# Altium schematic sheet ADC_Driver.SchDoc
size A4
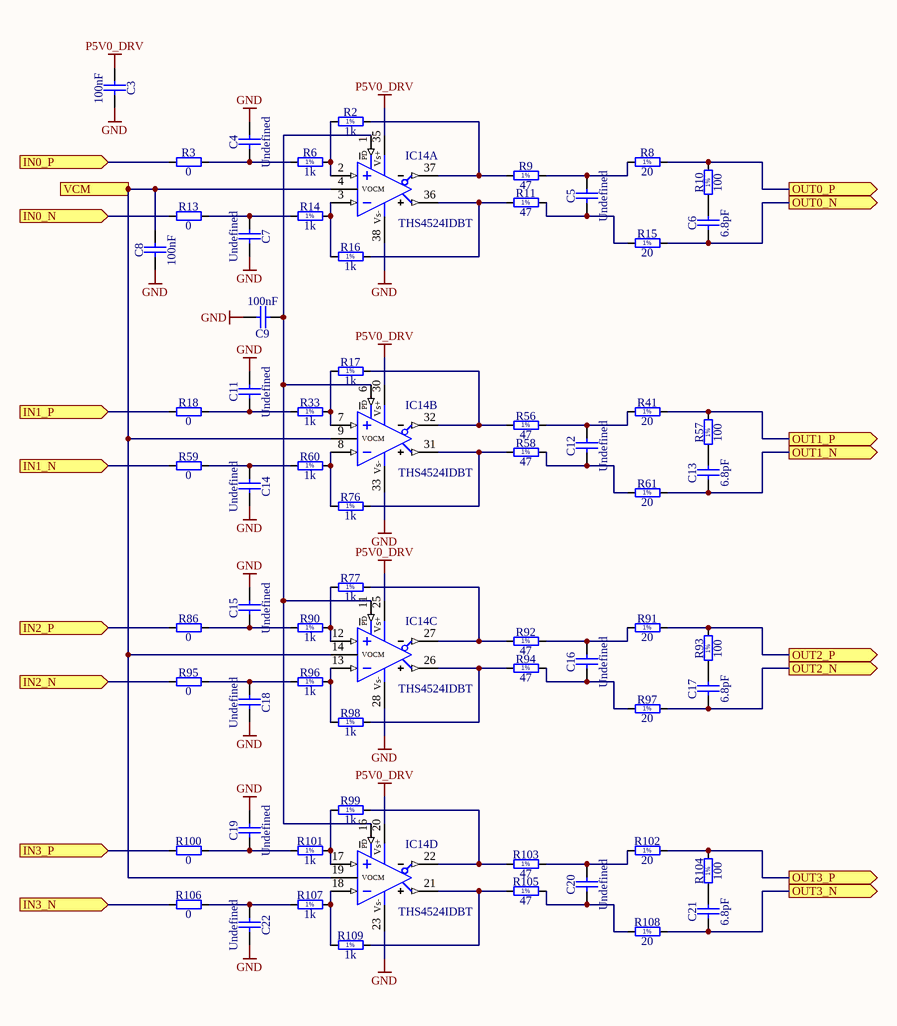
[diagram p0: ADC_Driver.SchDoc]

## Parts
C3  100nF  [CAPC0603X33N]
C4  Undefined  [CAPC1005X55N]
C5  Undefined  [CAPC1005X55N]
C6  6.8pF  [CAPC1005X70N]
C7  Undefined  [CAPC1005X55N]
C8  100nF  [CAPC0603X33N]
C9  100nF  [CAPC0603X33N]
C11  Undefined  [CAPC1005X55N]
C12  Undefined  [CAPC1005X55N]
C13  6.8pF  [CAPC1005X70N]
C14  Undefined  [CAPC1005X55N]
C15  Undefined  [CAPC1005X55N]
C16  Undefined  [CAPC1005X55N]
C17  6.8pF  [CAPC1005X70N]
C18  Undefined  [CAPC1005X55N]
C19  Undefined  [CAPC1005X55N]
C20  Undefined  [CAPC1005X55N]
C21  6.8pF  [CAPC1005X70N]
C22  Undefined  [CAPC1005X55N]
IC14  THS4524IDBT  [SOP50P640X120-38N]  (parts A,B,C,D of 5)
R2  1k  [RESC1005X40N]
R3  0  [RESC1005X40N]
R6  1k  [RESC1005X40N]
R8  20  [RESC1005X40N]
R9  47  [RESC1005X40N]
R10  100  [RESC0603X28N]
R11  47  [RESC1005X40N]
R13  0  [RESC1005X40N]
R14  1k  [RESC1005X40N]
R15  20  [RESC1005X40N]
R16  1k  [RESC1005X40N]
R17  1k  [RESC1005X40N]
R18  0  [RESC1005X40N]
R33  1k  [RESC1005X40N]
R41  20  [RESC1005X40N]
R56  47  [RESC1005X40N]
R57  100  [RESC0603X28N]
R58  47  [RESC1005X40N]
R59  0  [RESC1005X40N]
R60  1k  [RESC1005X40N]
R61  20  [RESC1005X40N]
R76  1k  [RESC1005X40N]
R77  1k  [RESC1005X40N]
R86  0  [RESC1005X40N]
R90  1k  [RESC1005X40N]
R91  20  [RESC1005X40N]
R92  47  [RESC1005X40N]
R93  100  [RESC0603X28N]
R94  47  [RESC1005X40N]
R95  0  [RESC1005X40N]
R96  1k  [RESC1005X40N]
R97  20  [RESC1005X40N]
R98  1k  [RESC1005X40N]
R99  1k  [RESC1005X40N]
R100  0  [RESC1005X40N]
R101  1k  [RESC1005X40N]
R102  20  [RESC1005X40N]
R103  47  [RESC1005X40N]
R104  100  [RESC0603X28N]
R105  47  [RESC1005X40N]
R106  0  [RESC1005X40N]
R107  1k  [RESC1005X40N]
R108  20  [RESC1005X40N]
R109  1k  [RESC1005X40N]

## Ports
IN0_N (in), IN0_P (in), IN1_N (in), IN1_P (in), IN2_N (in), IN2_P (in), IN3_N (in), IN3_P (in), OUT0_N (out), OUT0_P (out), OUT1_N (out), OUT1_P (out), OUT2_N (out), OUT2_P (out), OUT3_N (out), OUT3_P (out), VCM (in)

## Nets
GND: C3.2 C4.2 C7.2 C8.1 C9.2 C11.2 C14.2 C15.2 C18.2 C19.2 C22.2 IC14.23(Vs-) IC14.28(Vs-) IC14.33(Vs-) IC14.38(Vs-)
P5V0_DRV: C3.1 IC14.20(Vs+) IC14.25(Vs+) IC14.30(Vs+) IC14.35(Vs+)
IN0_N: R13.1 ; port IN0_N
IN0_P: R3.1 ; port IN0_P
IN1_N: R59.1 ; port IN1_N
IN1_P: R18.1 ; port IN1_P
IN2_N: R95.1 ; port IN2_N
IN2_P: R86.1 ; port IN2_P
IN3_N: R106.1 ; port IN3_N
IN3_P: R100.1 ; port IN3_P
OUT0_N: C6.1 R15.2 ; port OUT0_N
OUT0_P: R8.2 R10.2 ; port OUT0_P
OUT1_N: C13.1 R61.2 ; port OUT1_N
OUT1_P: R41.2 R57.2 ; port OUT1_P
OUT2_N: C17.1 R97.2 ; port OUT2_N
OUT2_P: R91.2 R93.2 ; port OUT2_P
OUT3_N: C21.1 R108.2 ; port OUT3_N
OUT3_P: R102.2 R104.2 ; port OUT3_P
VCM: C8.2 IC14.4(VOCM) IC14.9(VOCM) IC14.14(VOCM) IC14.19(VOCM) ; port VCM
NetC4_1: C4.1 R3.2 R6.1
NetC5_1: C5.1 R11.2 R15.1
NetC5_2: C5.2 R8.1 R9.2
NetC6_2: C6.2 R10.1
NetC7_1: C7.1 R13.2 R14.1
NetC9_1: C9.1 IC14.1(~{PD}) IC14.6(~{PD}) IC14.11(~{PD}) IC14.16(~{PD})
NetC11_1: C11.1 R18.2 R33.1
NetC12_1: C12.1 R58.2 R61.1
NetC12_2: C12.2 R41.1 R56.2
NetC13_2: C13.2 R57.1
NetC14_1: C14.1 R59.2 R60.1
NetC15_1: C15.1 R86.2 R90.1
NetC16_1: C16.1 R94.2 R97.1
NetC16_2: C16.2 R91.1 R92.2
NetC17_2: C17.2 R93.1
NetC18_1: C18.1 R95.2 R96.1
NetC19_1: C19.1 R100.2 R101.1
NetC20_1: C20.1 R105.2 R108.1
NetC20_2: C20.2 R102.1 R103.2
NetC21_2: C21.2 R104.1
NetC22_1: C22.1 R106.2 R107.1
NetIC14_2: IC14.2(IN+) R2.1 R6.2
NetIC14_3: IC14.3(IN-) R14.2 R16.1
NetIC14_7: IC14.7(IN+) R17.1 R33.2
NetIC14_8: IC14.8(IN-) R60.2 R76.1
NetIC14_12: IC14.12(IN+) R77.1 R90.2
NetIC14_13: IC14.13(IN-) R96.2 R98.1
NetIC14_17: IC14.17(IN+) R99.1 R101.2
NetIC14_18: IC14.18(IN-) R107.2 R109.1
NetIC14_21: IC14.21(VOUT+) R105.1 R109.2
NetIC14_22: IC14.22(VOUT-) R99.2 R103.1
NetIC14_26: IC14.26(VOUT+) R94.1 R98.2
NetIC14_27: IC14.27(VOUT-) R77.2 R92.1
NetIC14_31: IC14.31(VOUT+) R58.1 R76.2
NetIC14_32: IC14.32(VOUT-) R17.2 R56.1
NetIC14_36: IC14.36(VOUT+) R11.1 R16.2
NetIC14_37: IC14.37(VOUT-) R2.2 R9.1

## Notes on the sheet
- (in symbol R0201_100R_1%_0.05W_200PPM) 1%
- (in symbol R0402_1K_1%_0.0625W_100PPM) 1%
- (in symbol R0402_20R_1%_0.0625W_100PPM) 1%
- (in symbol R0402_47R_1%_0.0625W_100PPM) 1%
- (in symbol THS4524IDBT, part A) PD
- (in symbol THS4524IDBT, part B) PD
- (in symbol THS4524IDBT, part C) PD
- (in symbol THS4524IDBT, part D) PD

## Library data of the parts
C3 C8 C9 = CC0201_100NF_6.3V_10%_X5R: Non-polarised capacitor; Part Description: SMD Multilayer Chip Ceramic Capacitor; Manufacturer: GENERIC; Manufacturer1 Part Number: 02016D104KAT2A; Voltage: 6.3V; TC: X5R; Tolerance: ±10%; Part Number: CC0201_100NF_6.3V_10%_X5R; Component Kind: Standard; Component Type: Standard; Pin Count: 2; Value: 100nF; Status: Not Recommended; Manufacturer Part Number: CC0201_100NF_6.3V_10%_X5R; Case: 0201; Mounted: Yes; Socket: No; SMD: Yes; Sense: No; Manufacturer1 Example: AVX; Manufacturer1 ComponentHeight: 0.33mm; HelpURL: \\cern.ch\dfs\Applications\Altium\Datasheets\CC0201_X5R_AVX.pdf; Author: CERN DEM JLC; CreateDate: 03.12.2007; LatestRevisionDate: 03.12.2007
C4 C5 C7 C11 C12 C14-C16 C18-C20 C22 = CC0402_NO-VALUE: Non-polarised capacitor; Part Description: Reserved Footprint For 0402(1005) Chip Ceramic Capacitor; Mounted: No; Part Number: CC0402_NO-VALUE; Component Kind: Standard; Component Type: Standard; Pin Count: 2; Value: Undefined; Status: None; Manufacturer: Undefined; Manufacturer Part Number: CC0402_NO-VALUE; Case: 0402; Socket: No; SMD: Yes; Sense: No; Manufacturer1 ComponentHeight: 0.55mm; HelpURL: Undefined; Author: CERN DEM JLC; CreateDate: 14.01.2014; LatestRevisionDate: 14.01.2014
C6 C13 C17 C21 = CC0402_6.8PF_50V_0.25PF_C0G_VISHAY_VJ_NON-MAGNETIC: Non-polarised capacitor; Part Description: Surface Mount Multilayer Ceramic Chip Capacitors for Non-Magnetic Applications (IR Reflow Soldering); Manufacturer: VISHAY VITRAMON; Manufacturer Part Number: VJ0402A6R8CCAA; Voltage: 50V; TC: C0G/NP0; Tolerance: ±0.25pF; Part Number: CC0402_6.8PF_50V_0.25PF_C0G_VISHAY_VJ_NON-MAGNETIC; Component Kind: Standard; Component Type: Standard; Pin Count: 2; Value: 6.8pF; Status: Not Recommended; Case: 0402; Mounted: Yes; Socket: No; SMD: Yes; Sense: No; ComponentHeight: 0.64mm; HelpURL: \\cern.ch\dfs\Applications\Altium\Datasheets\CC0402_VISHAY_VJ_NON-MAGNETIC.pdf; Author: CERN DEM MR; CreateDate: 22.06.2016; LatestRevisionDate: 03.03.2017
IC14 = THS4524IDBT: Very Low Power Quad Channel Rail-to-Rail Output Fully Differential Amplifier; Manufacturer: TEXAS INSTRUMENTS; PressFit: No; Bonding: No; Part Number: THS4524IDBT; Component Kind: Standard; Component Type: Standard; Device: THS4524IDBT; PackageDescription: SOP, 0.50mm pitch; 38 pin, 4.40mm W X 9.70mm L X 1.20mm H body, IPC Medium Density; Part Description: Very Low Power Quad Channel Rail-to-Rail Output Fully Differential Amplifier; Manufacturer Part Number: THS4524IDBT; Pin Count: 38; Case: TSSOP38; Mounted: Yes; Socket: No; SMD: Yes; Sense: No; ComponentHeight: 1.2mm; Author: CERN DEM JLC; HelpURL: \\cern.ch\dfs\Applications\Altium\Datasheets\THS4524IDBT.pdf; CreateDate: 23.11.2009; LatestRevisionDate: 23.11.2009
R2 R6 R14 R16 R17 R33 R60 R76 R77 R90 R96 R98 R99 R101 R107 R109 = R0402_1K_1%_0.0625W_100PPM: Resistor - 1%; Part Description: General Purpose Thick Film Chip Resistor; Manufacturer: GENERIC; Manufacturer1 Part Number: 232270671002L; TC: ±100ppm/°C; PressFit: No; Part Number: R0402_1K_1%_0.0625W_100PPM; Component Kind: Standard; Component Type: Standard; Pin Count: 2; Value: 1k; Status: Not Recommended; Power: 0.0625W; Tolerance: ±1%; Manufacturer Part Number: R0402_1K_1%_0.0625W_100PPM; Case: 0402; Mounted: Yes; Sense: No; Socket: No; SMD: Yes; Manufacturer1 Example: YAGEO PHYCOMP; Manufacturer1 ComponentHeight: 0.4mm; HelpURL: \\cern.ch\dfs\Applications\Altium\Datasheets\R0402_Phycomp_RC0402.pdf; Author: CERN DEM JLC; CreateDate: 03.12.2007; LatestRevisionDate: 17.10.2012
R3 R13 R18 R59 R86 R95 R100 R106 = R0402_0R_JUMPER: Resistor; Part Description: 1A (0.05R Max DC Resistance) Zero Ohm Jumper; Manufacturer: GENERIC; Manufacturer1 Part Number: 232270591001L; PressFit: No; Part Number: R0402_0R_JUMPER; Component Kind: Standard; Component Type: Standard; Pin Count: 2; Value: 0; Status: Not Recommended; Manufacturer Part Number: R0402_0R_JUMPER; Case: 0402; Mounted: Yes; Sense: No; Socket: No; SMD: Yes; Manufacturer1 Example: YAGEO PHYCOMP; Manufacturer1 ComponentHeight: 0.4mm; HelpURL: \\cern.ch\dfs\Applications\Altium\Datasheets\R0402_Phycomp_RC0402.pdf; Author: CERN DEM JLC; CreateDate: 03.12.2007; LatestRevisionDate: 17.10.2012
R8 R15 R41 R61 R91 R97 R102 R108 = R0402_20R_1%_0.0625W_100PPM: Resistor - 1%; Part Description: General Purpose Thick Film Chip Resistor; Manufacturer: GENERIC; Manufacturer1 Part Number: 232270672009L; TC: ±100ppm/°C; PressFit: No; Part Number: R0402_20R_1%_0.0625W_100PPM; Component Kind: Standard; Component Type: Standard; Pin Count: 2; Value: 20; Status: Not Recommended; Power: 0.0625W; Tolerance: ±1%; Manufacturer Part Number: R0402_20R_1%_0.0625W_100PPM; Case: 0402; Mounted: Yes; Sense: No; Socket: No; SMD: Yes; Manufacturer1 Example: YAGEO PHYCOMP; Manufacturer1 ComponentHeight: 0.4mm; HelpURL: \\cern.ch\dfs\Applications\Altium\Datasheets\R0402_Phycomp_RC0402.pdf; Author: CERN DEM JLC; CreateDate: 03.12.2007; LatestRevisionDate: 17.10.2012
R9 R11 R56 R58 R92 R94 R103 R105 = R0402_47R_1%_0.0625W_100PPM: Resistor - 1%; Part Description: General Purpose Thick Film Chip Resistor; Manufacturer: GENERIC; Manufacturer1 Part Number: 232270674709L; TC: ±100ppm/°C; PressFit: No; Part Number: R0402_47R_1%_0.0625W_100PPM; Component Kind: Standard; Component Type: Standard; Pin Count: 2; Value: 47; Status: Not Recommended; Power: 0.0625W; Tolerance: ±1%; Manufacturer Part Number: R0402_47R_1%_0.0625W_100PPM; Case: 0402; Mounted: Yes; Sense: No; Socket: No; SMD: Yes; Manufacturer1 Example: YAGEO PHYCOMP; Manufacturer1 ComponentHeight: 0.4mm; HelpURL: \\cern.ch\dfs\Applications\Altium\Datasheets\R0402_Phycomp_RC0402.pdf; Author: CERN DEM JLC; CreateDate: 03.12.2007; LatestRevisionDate: 17.10.2012
R10 R57 R93 R104 = R0201_100R_1%_0.05W_200PPM: Resistor - 1%; Part Description: Thick Film Chip Resistor; Manufacturer: GENERIC; Manufacturer1 Part Number: CRCW0201100RFNED; Power: 0.05W; TC: ±200ppm/°C; PressFit: No; Part Number: R0201_100R_1%_0.05W_200PPM; Component Kind: Standard; Component Type: Standard; Pin Count: 2; Value: 100; Status: Not Recommended; Tolerance: ±1%; Manufacturer Part Number: R0201_100R_1%_0.05W_200PPM; Case: 0201; Mounted: Yes; Sense: No; Socket: No; SMD: Yes; Manufacturer1 Example: VISHAY; Manufacturer1 ComponentHeight: 0.27mm; HelpURL: \\cern.ch\dfs\Applications\Altium\Datasheets\R0201_VISHAY_CRCW0201 e3.pdf; Author: CERN DEM JLC; CreateDate: 13.11.2014; LatestRevisionDate: 13.11.2014